# Altium schematic sheet Sunfish_ECU_RevA.SchDoc
size A3; _PRJ_TITLE: PROJECT TITLE; _SHT_TITLE: Sheet; _REV: A; PageSetup: Record=PageOptions|CenterHorizontal=True|CenterVertical=True|PrintScale=0.71|XCorrection=1.00|YCorrection=1.00|PrintKind=0|BorderSize=5000000|LeftOffset=0|BottomOffset=0|Orientation=2|PaperLength=1000|PaperWidth=1000|Scale=100|PaperSource=258|PrintQuality=600|MediaType=1|DitherType=10|PaperKind=A3 (297x420mm)|PrintScaleMode=1
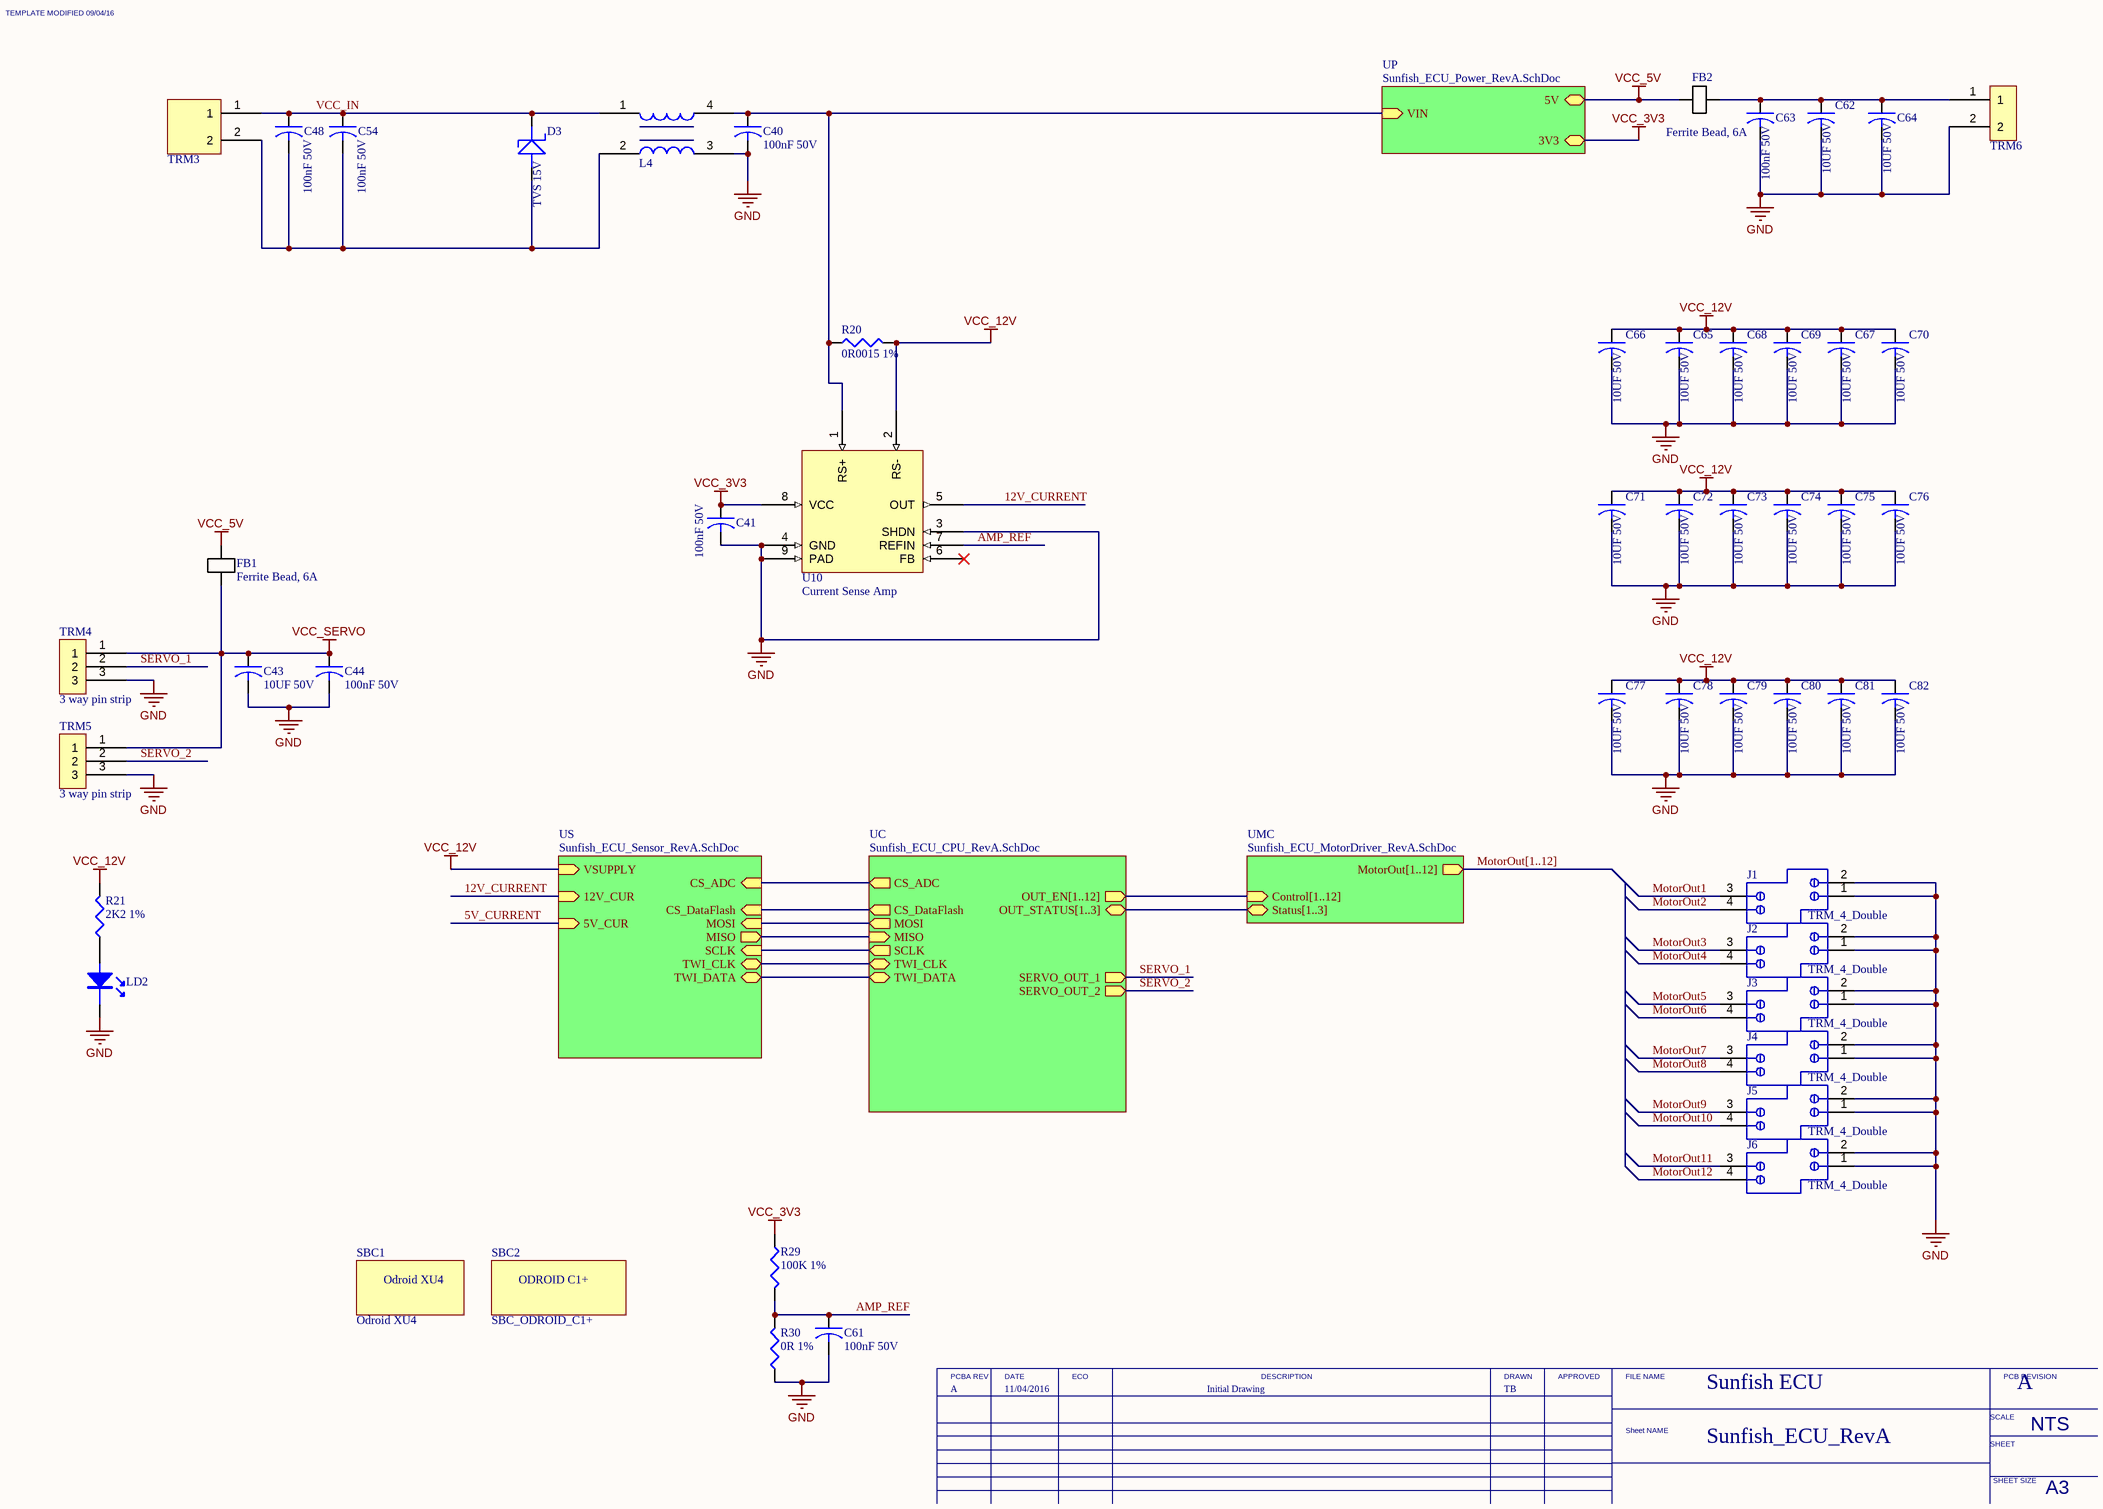
[diagram p0: Sunfish_ECU_RevA.SchDoc]

## Parts
C40  100nF 50V  [0603]
C41  100nF 50V  [0603]
C43  10UF 50V  [1206]
C44  100nF 50V  [0603]
C48  100nF 50V  [0603]
C54  100nF 50V  [0603]
C61  100nF 50V  [0603]
C62  10UF 50V  [1206]
C63  100nF 50V  [0603]
C64  10UF 50V  [1206]
C65  10UF 50V  [1206]
C66  10UF 50V  [1206]
C67  10UF 50V  [1206]
C68  10UF 50V  [1206]
C69  10UF 50V  [1206]
C70  10UF 50V  [1206]
C71  10UF 50V  [1206]
C72  10UF 50V  [1206]
C73  10UF 50V  [1206]
C74  10UF 50V  [1206]
C75  10UF 50V  [1206]
C76  10UF 50V  [1206]
C77  10UF 50V  [1206]
C78  10UF 50V  [1206]
C79  10UF 50V  [1206]
C80  10UF 50V  [1206]
C81  10UF 50V  [1206]
C82  10UF 50V  [1206]
D3  TVS 15V  [DO-214AB]
FB1  Ferrite Bead, 6A  [1806]
FB2  Ferrite Bead, 6A  [1806]
J1  TRM_4_Double  [691230110004]
J2  TRM_4_Double  [691230110004]
J3  TRM_4_Double  [691230110004]
J4  TRM_4_Double  [691230110004]
J5  TRM_4_Double  [691230110004]
J6  TRM_4_Double  [691230110004]
L4  CHOKE COM MODE ULTRA HC 100 OHMS  [Choke_CM5441Z101B-10]  (value not drawn)
LD2  Green LED 0805  [0805DIODE]  (value not drawn)
R20  0R0015 1%  [2512]
R21  2K2 1%  [0603]
R29  100K 1%  [0603]
R30  0R 1%  [0603]
SBC1  Odroid XU4  [ODROID_XU4]
SBC2  SBC_ODROID_C1+  [SBC_ODROID_C1+]
TRM3  2way screw terminal, High current  [TERM_2POS_HORIZ_7.62MM]  (value not drawn)
TRM4  3 way pin strip  [SIP_3]
TRM5  3 way pin strip  [SIP_3]
TRM6  Wurth 2way screw terminal  [TERM_2POS_HORIZ_5.08MM]  (value not drawn)
U10  Current Sense Amp  [SOIC127P600X168_HS-8M]

## Sub-sheets
UC = Sunfish_ECU_CPU_RevA.SchDoc: OUT_EN[1..12] (out), CS_ADC (out), MOSI (out), TWI_DATA (bidir), TWI_CLK (bidir), OUT_STATUS[1..3] (bidir), SCLK (out), CS_DataFlash (out), MISO (in), SERVO_OUT_1 (out), SERVO_OUT_2 (out)
UMC = Sunfish_ECU_MotorDriver_RevA.SchDoc: MotorOut[1..12] (out), Control[1..12] (in), Status[1..3] (bidir)
UP = Sunfish_ECU_Power_RevA.SchDoc: 5V (bidir), 3V3 (bidir), VIN (in)
US = Sunfish_ECU_Sensor_RevA.SchDoc: 12V_CUR (in), VSUPPLY (in), CS_ADC (in), TWI_DATA (bidir), CS_DataFlash (in), SCLK (in), TWI_CLK (bidir), MOSI (in), MISO (out), 5V_CUR (in)

## Nets
GND: C40.2 C41.2 C43.2 C44.2 C61.2 C62.2 C63.2 C64.2 C65.2 C66.2 C67.2 C68.2 C69.2 C70.2 C71.2 C72.2 C73.2 C74.2 C75.2 C76.2 C77.2 C78.2 C79.2 C80.2 C81.2 C82.2 J1.1 J1.2 J2.1 J2.2 J3.1 J3.2 J4.1 J4.2 J5.1 J5.2 J6.1 J6.2 L4.3 LD2.K R30.1 TRM4.3 TRM5.3 TRM6.2 U10.3(SHDN) U10.4(GND) U10.9(PAD)
VCC_3V3: C41.1 R29.2 U10.8(VCC) ; sheet UP/3V3
VCC_5V: FB1.1 FB2.1 ; sheet UP/5V
VCC_12V: C65.1 C66.1 C67.1 C68.1 C69.1 C70.1 C71.1 C72.1 C73.1 C74.1 C75.1 C76.1 C77.1 C78.1 C79.1 C80.1 C81.1 C82.1 R20.2 R21.2 U10.2(RS-) ; sheet US/VSUPPLY
VCC_SERVO: C43.1 C44.1 FB1.2 TRM4.1 TRM5.1
5V_CURRENT: sheet US/5V_CUR
12V_CURRENT: U10.5(OUT) ; sheet US/12V_CUR
AMP_REF: C61.1 R29.1 R30.2 U10.7(REFIN)
MotorOut1: J1.3
MotorOut2: J1.4
MotorOut3: J2.3
MotorOut4: J2.4
MotorOut5: J3.3
MotorOut6: J3.4
MotorOut7: J4.3
MotorOut8: J4.4
MotorOut9: J5.3
MotorOut10: J5.4
MotorOut11: J6.3
MotorOut12: J6.4
SERVO_1: TRM4.2 ; sheet UC/SERVO_OUT_1
SERVO_2: TRM5.2 ; sheet UC/SERVO_OUT_2
VCC_IN: C48.1 C54.1 D3.K L4.1 TRM3.1
NetC40_1: C40.1 L4.4 R20.1 U10.1(RS+) ; sheet UP/VIN
NetC48_2: C48.2 C54.2 D3.A L4.2 TRM3.2
NetC62_1: C62.1 C63.1 C64.1 FB2.2 TRM6.1
NetLD2_A: LD2.A R21.1
(unnamed): sheet UC/CS_ADC, sheet US/CS_ADC
(unnamed): sheet UC/MOSI, sheet US/MOSI
(unnamed): sheet UC/TWI_DATA, sheet US/TWI_DATA
(unnamed): sheet UC/TWI_CLK, sheet US/TWI_CLK
(unnamed): sheet UC/SCLK, sheet US/SCLK
(unnamed): sheet UC/CS_DataFlash, sheet US/CS_DataFlash
(unnamed): sheet UC/MISO, sheet US/MISO

Not connected (* = marked no-connect by the designer): U10 6(FB)*

## Buses and harness runs
bus MotorOut[1..12] = sheet UMC/MotorOut[1..12]
bus sheet UC/OUT_EN[1..12] = sheet UMC/Control[1..12]
bus sheet UC/OUT_STATUS[1..3] = sheet UMC/Status[1..3]

## Notes on the sheet
- A
- 11/04/2016
- Initial Drawing
- TB
- Sunfish ECU
- Sunfish_ECU_RevA
- TEMPLATE MODIFIED 09/04/16
- PCBA REV
- DATE
- ECO
- DESCRIPTION
- DRAWN
- APPROVED
- FILE NAME
- PCB REVISION
- Sheet NAME
- SCALE
- SHEET
- NTS
- SHEET SIZE
- A3
- (in symbol SBC_ODROID_C1+) ODROID C1+

## Library data of the parts
C40 C41 C44 C48 C54 C61 C63 = CAP_100NF_50V_10%_0603: CAP CER 100nF 50V 10% X7R 0603; Manufacturer: Murata; Manufacturer P/N: GRM188R71H104KA93D
C43 C62 C64-C82 = CAP_10UF_50V_10%_1206: CAP CER 10UF 50V 10% X5R 1206; Manufacturer: Murata; Manufacturer P/N: GRM31CR61H106KA12L
D3 = DIODE_TVS_SMCJ15A: TVS Diode, 15V; Manufacturer: LIttlefuse; Manufacturer P/N: SMCJ15A
FB1 FB2 = IND_FERRITE_ BLM41PG600SN1L: Manufacturer: MURATA; Manufacturer P/N: BLM41PG600SN1L
J1-J6 = TRM_4_Double: WR-TBL Terminal Blocks Serie 2301 - 3.50 mm with Rising Clamp; Manufacturer: Würth Elektronik eiSos GmbH; ComponentLink1 Description: Manufacturer; ComponentLink2 Description: Datasheet; NoPins: 4; Created Date: 8 Novenber 2013; partNo: 691230110004; ComponentLink1URL: http://www.we-online.com; ComponentLink2URL: http://katalog.we-online.de/em/datasheet/6912301100xx.pdf; Created by: Karrer Zheng
L4 = CHOKE_COM_MODE_100MHz: Manufacturer: Laird-Signal Integrity Products; Manufacturer P/N: CM5441Z101B-10
LD2 = LED_Green_0805: WL-SMCW SMD CHIP LED WATERCLEAR; Manufacturer: Wurth; Manufacturer P/N: 150080VS75000
R20 = RES_0R0015_1%_2512: Resistor, 0R0015, 1%, 2512; Manufacturer: Riedon; Manufacturer P/N: CSR2512C0R0015F
R21 = RES_2K2_1%_0603: Resistor, 2K2, 1%, 0603; Manufacturer: Bourns Inc; Manufacturer P/N: CR0603-FX-2201ELF
R29 = RES_100K_1%_0603: Resistor, 100K, 1%, 0603; Manufacturer: Bourns Inc; Manufacturer P/N: CRT0603-BY-1003ELF
R30 = RES_0R_1%_0603_1: Resistor, 0R, 1%, 0603; Manufacturer: Bourns Inc; Manufacturer P/N: CR0603-J/-000ELF
SBC1 = SBC_ODROID_XU4
TRM3 = TRM_2way_ScrewTerminal_7.62mm: TERM BLOCK 2POS HORIZ 7.62MM T/H; Manufacturer: Altronics; Manufacturer P/N: P4343
TRM4 TRM5 = TRM_3WaySocket: Manufacturer: N/A; Manufacturer P/N: N/A
TRM6 = TRM_2way_ScrewTerminal: TERM BLOCK 2POS HORIZ 5.08MM T/H; Manufacturer: Wurth Electronics Inc; Manufacturer P/N: 691216510002
U10 = IC_OPAMP_MAX9920+: IC OPAMP CURR SENSE 230KHZ 8SOIC; Manufacturer: Maxim Intergrated; Manufacturer P/N: MAX9920ASA+